# EAGLE design w5500-004 (EAGLE 6.5.0)
Assembly variants: Standard
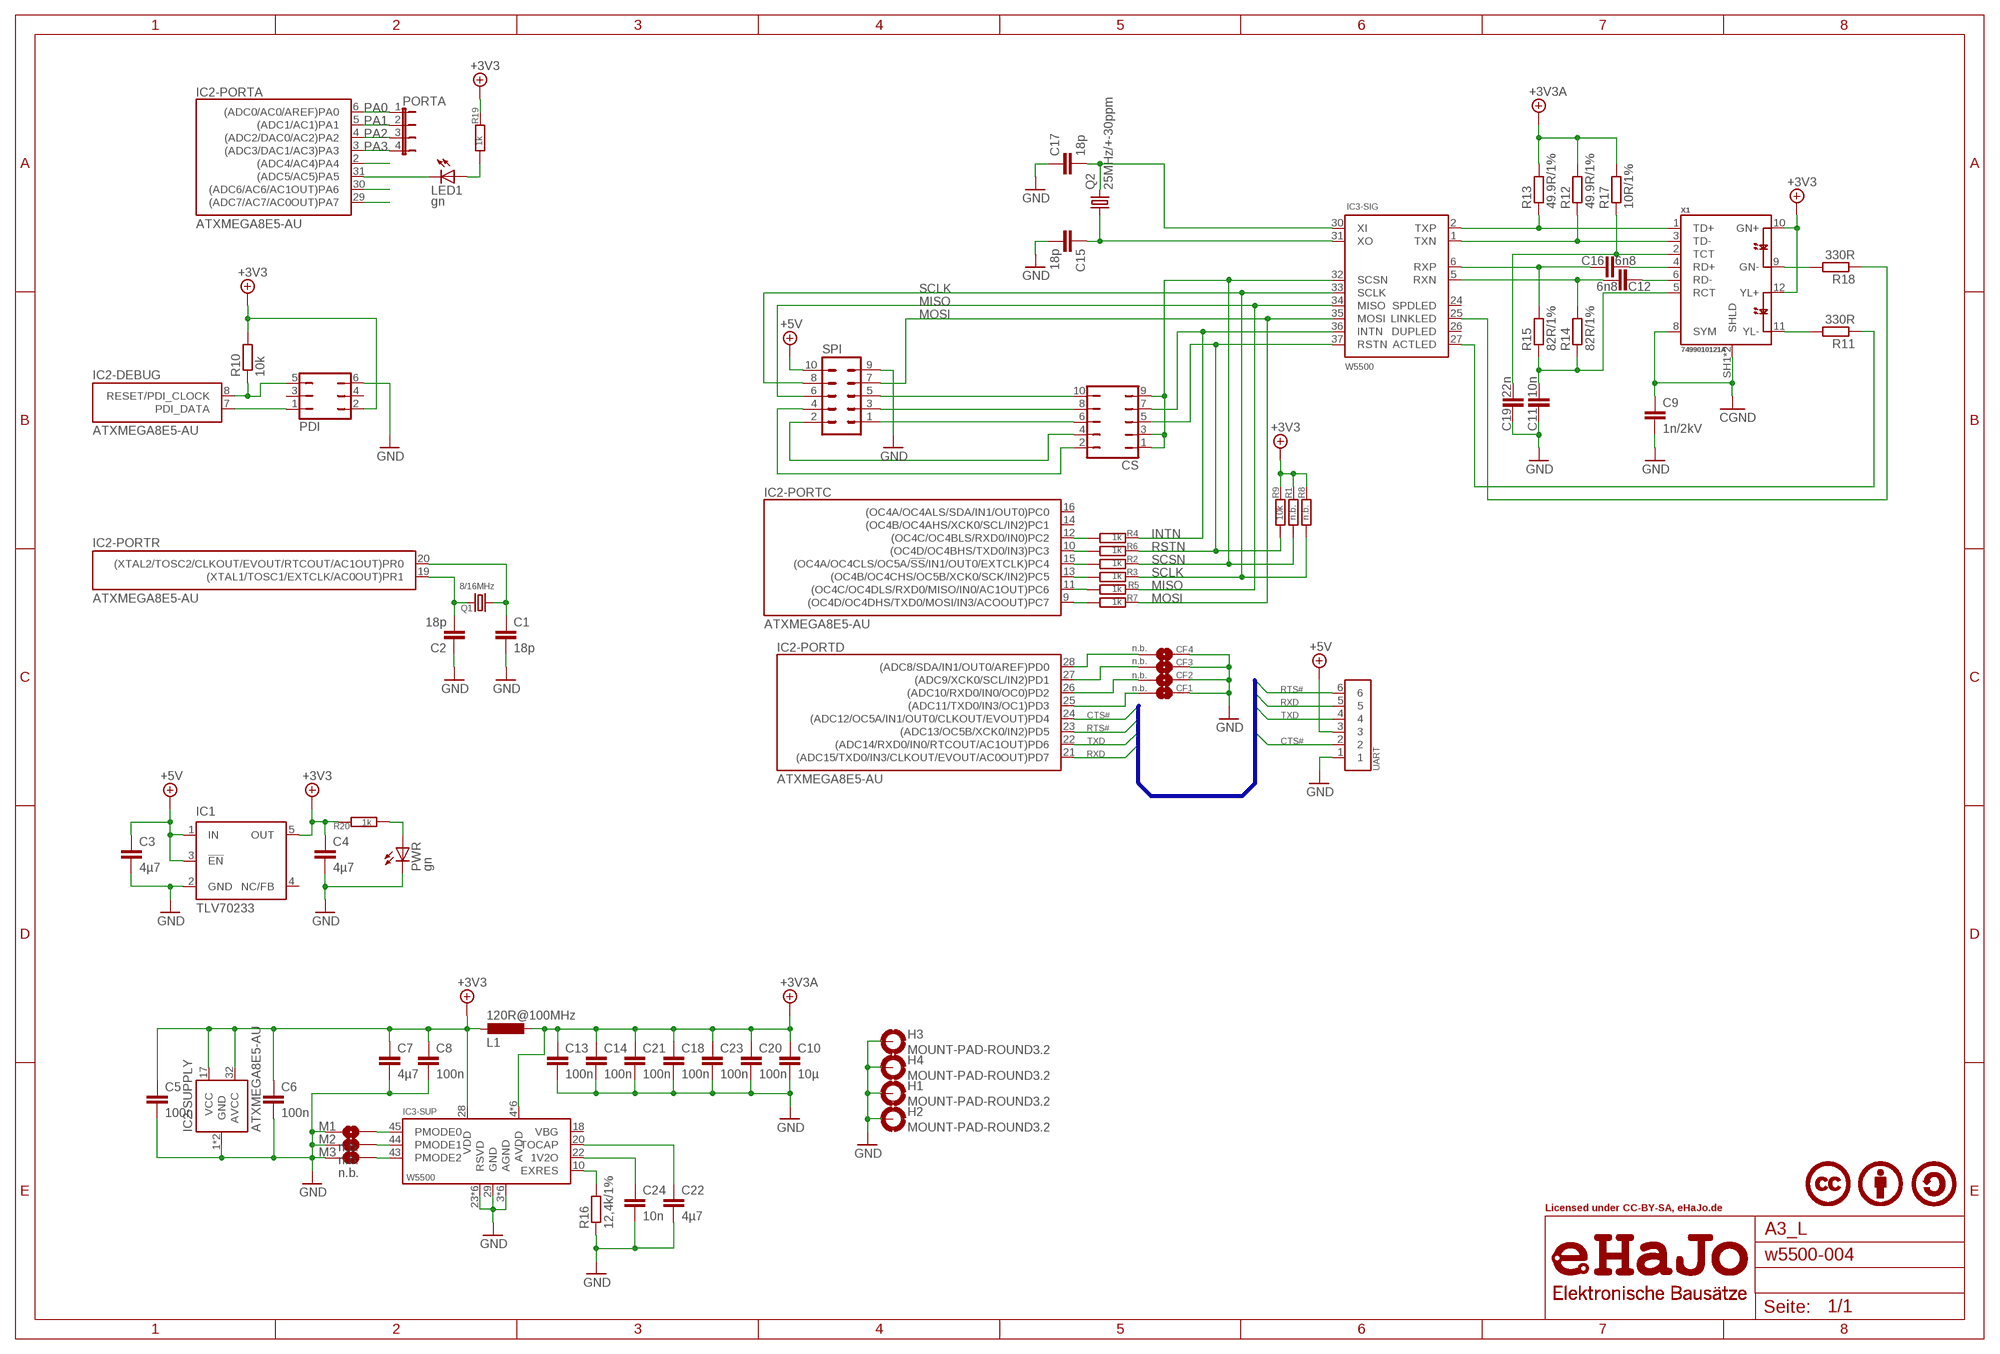
[diagram p0: schematic, sheet 1]

## Parts
C1  18p  CC0603  [C0603]
C2  18p  CC0603  [C0603]
C3  4µ7  CC0805  [C0805]
C4  4µ7  CC0805  [C0805]
C5  100n  CC0603  [C0603]
C6  100n  CC0603  [C0603]
C7  4µ7  CC0805  [C0805]
C8  100n  CC0603  [C0603]
C9  1n/2kV  CC0805  [C0805]
C10  10µ  CC1206  [C1206]
C11  10n  CC0603  [C0603]
C12  6n8  CC0603  [C0603]
C13  100n  CC0603  [C0603]
C14  100n  CC0603  [C0603]
C15  18p  CC0603  [C0603]
C16  6n8  CC0603  [C0603]
C17  18p  CC0603  [C0603]
C18  100n  CC0603  [C0603]
C19  22n  CC0603  [C0603]
C20  100n  CC0603  [C0603]
C21  100n  CC0603  [C0603]
C22  4µ7  CC0805  [C0805]
C23  100n  CC0603  [C0603]
C24  10n  CC0603  [C0603]
CF1  n.b.  SJS  [SJS]
CF2  n.b.  SJS  [SJS]  (not fitted in variant Standard)
CF3  n.b.  SJS  [SJS]  (not fitted in variant Standard)
CF4  n.b.  SJS  [SJS]  (not fitted in variant Standard)
CS  JP5Q  [JP5Q]  (not fitted in variant Standard)
H1  MOUNT-PAD-ROUND3.2  [3,2-PAD]  (not fitted in variant Standard)
H2  MOUNT-PAD-ROUND3.2  [3,2-PAD]  (not fitted in variant Standard)
H3  MOUNT-PAD-ROUND3.2  [3,2-PAD]  (not fitted in variant Standard)
H4  MOUNT-PAD-ROUND3.2  [3,2-PAD]  (not fitted in variant Standard)
IC1  TLV70233  TPS77001  [SOT23-DBV]
IC2  ATXMEGA8E5-AU  ATXMEGAE5-AU  [TQFP32-08]
IC3  W5500  [LQFP48]
L1  120R@100MHz  L0805  [R0805]
LED1  gn  LEDCHIP-LED0805  [CHIP-LED0805]
M1  n.b.  SJS  [SJS]  (not fitted in variant Standard)
M2  n.b.  SJS  [SJS]  (not fitted in variant Standard)
M3  n.b.  SJS  [SJS]  (not fitted in variant Standard)
PDI  JP3Q  [JP3Q]
PORTA  JP4ESML  [4SML]
PWR  gn  LEDCHIP-LED0805  [CHIP-LED0805]
Q1  8/16MHz  CRYSTALHC49U70  [HC49U70]  (not fitted in variant Standard)
Q2  25MHz/+-30ppm  CRYSTALHC49U70  [HC49U70]  (not fitted in variant Standard)
R1  n.b.  RR0603  [R0603]
R2  1k  RR0603  [R0603]
R3  1k  RR0603  [R0603]
R4  1k  RR0603  [R0603]
R5  1k  RR0603  [R0603]
R6  1k  RR0603  [R0603]
R7  1k  RR0603  [R0603]
R8  n.b.  RR0603  [R0603]
R9  10k  RR0603  [R0603]
R10  10k  RR0603  [R0603]
R11  330R  RR0603  [R0603]
R12  49.9R/1%  RR0603  [R0603]
R13  49.9R/1%  RR0603  [R0603]
R14  82R/1%  RR0603  [R0603]
R15  82R/1%  RR0603  [R0603]
R16  12,4k/1%  RR0603  [R0603]
R17  10R/1%  RR0603  [R0603]
R18  330R  RR0603  [R0603]
R19  1k  RR0603  [R0603]
R20  1k  RR0603  [R0603]
SPI  ML10  [ML10]  (not fitted in variant Standard)
UART  JP6E  [JP6E]  (not fitted in variant Standard)
X1  7499010121A  7499010121  [121A]  (not fitted in variant Standard)

## Nets
+3V3: C4.1 C5.1 C6.1 C7.1 C8.1 IC1.5(OUT) IC2.17(-SUPPLY:VCC) IC2.32(-SUPPLY:AVCC) IC3.28(-SUP:VDD) L1.2 PDI.2 R1.2 R8.2 R9.2 R10.2 R19.2 R20.2 X1.10(GN+) X1.12(YL+)
+3V3A: C10.1 C13.1 C14.1 C18.1 C20.1 C21.1 C23.1 IC3.4(-SUP:AVDD) IC3.8(-SUP:AVDD) IC3.11(-SUP:AVDD) IC3.15(-SUP:AVDD) IC3.17(-SUP:AVDD) IC3.21(-SUP:AVDD) L1.1 R12.2 R13.2 R17.2
+5V: C3.1 IC1.1(IN) IC1.3(!EN) SPI.10 UART.3
CGND: C9.1 X1.8(SYM) X1.SH1(SHLD) X1.SH2(SHLD)
CS1: CS.6 SPI.1
CS2: CS.4 SPI.2
CS3: CS.8 SPI.3
CS4: CS.2 SPI.4
CTS#: IC2.24(-PORTD:(ADC12/OC5A/IN1/OUT0/CLKOUT/EVOUT)PD4) UART.2
GND: C1.2 C2.1 C3.2 C4.2 C5.2 C6.2 C7.2 C8.2 C9.2 C10.2 C11.1 C13.2 C14.2 C15.2 C17.1 C18.2 C19.1 C20.2 C21.2 C22.2 C23.2 C24.2 CF1.2 CF2.2 CF3.2 CF4.2 H1.B3,2(MOUNT) H2.B3,2(MOUNT) H3.B3,2(MOUNT) H4.B3,2(MOUNT) IC1.2(GND) IC2.1(-SUPPLY:GND) IC2.18(-SUPPLY:GND) IC3.3(-SUP:AGND) IC3.9(-SUP:AGND) IC3.14(-SUP:AGND) IC3.16(-SUP:AGND) IC3.19(-SUP:AGND) IC3.23(-SUP:RSVD) IC3.29(-SUP:GND) IC3.38(-SUP:RSVD) IC3.39(-SUP:RSVD) IC3.40(-SUP:RSVD) IC3.41(-SUP:RSVD) IC3.42(-SUP:RSVD) IC3.48(-SUP:AGND) M1.1 M2.1 M3.1 PDI.6 PWR.C R16.1 SPI.9 UART.1
INTN: CS.7 IC3.36(-SIG:INTN) R4.1
MISO: IC3.34(-SIG:MISO) R5.1 SPI.6
MOSI: IC3.35(-SIG:MOSI) R7.1 SPI.7
N$1: IC3.10(-SUP:EXRES) R16.2
N$2: C24.1 IC3.22(-SUP:1V2O)
N$3: C22.1 IC3.20(-SUP:TOCAP)
N$4: IC3.45(-SUP:PMODE0) M1.2
N$5: R18.2 X1.9(GN-)
N$6: IC3.44(-SUP:PMODE1) M2.2
N$7: IC3.43(-SUP:PMODE2) M3.2
N$8: C15.1 IC3.31(-SIG:XO) Q2.1
N$9: C17.2 IC3.30(-SIG:XI) Q2.2
N$10: IC2.8(-DEBUG:RESET/PDI_CLOCK) PDI.5 R10.1
N$11: IC2.11(-PORTC:(OC4C/OC4DLS/RXD0/MISO/IN0/AC1OUT)PC6) R5.2
N$12: IC2.12(-PORTC:(OC4C/OC4BLS/RXD0/IN0)PC2) R4.2
N$13: IC2.15(-PORTC:(OC4A/OC4CLS/OC5A/!SS!/IN1/OUT0/EXTCLK)PC4) R2.2
N$14: IC2.9(-PORTC:(OC4D/OC4DHS/TXD0/MOSI/IN3/ACOOUT)PC7) R7.2
N$15: IC2.13(-PORTC:(OC4B/OC4CHS/OC5B/XCK0/SCK/IN2)PC5) R3.2
N$16: CF4.1 IC2.28(-PORTD:(ADC8/SDA/IN1/OUT0/AREF)PD0)
N$17: CF3.1 IC2.27(-PORTD:(ADC9/XCK0/SCL/IN2)PD1)
N$18: IC2.10(-PORTC:(OC4D/OC4BHS/TXD0/IN3)PC3) R6.2
N$19: CF2.1 IC2.26(-PORTD:(ADC10/RXD0/IN0/OC0)PD2)
N$20: IC2.7(-DEBUG:PDI_DATA) PDI.1
N$21: CF1.1 IC2.25(-PORTD:(ADC11/TXD0/IN3/OC1)PD3)
N$23: C16.2 X1.4(RD+)
N$24: C12.1 X1.6(RD-)
N$27: C11.2 R14.1 R15.1 X1.5(RCT)
N$28: C19.2 R17.1 X1.2(TCT)
N$29: R11.2 X1.11(YL-)
N$30: IC3.27(-SIG:ACTLED) R11.1
N$31: IC3.25(-SIG:LINKLED) R18.1
N$33: IC2.2(-PORTA:(ADC4/AC4)PA4)
N$34: IC2.31(-PORTA:(ADC5/AC5)PA5) LED1.C
N$35: IC2.30(-PORTA:(ADC6/AC6/AC1OUT)PA6)
N$36: IC2.29(-PORTA:(ADC7/AC7/AC0OUT)PA7)
N$37: C2.2 IC2.19(-PORTR:(XTAL1/TOSC1/EXTCLK/AC0OUT)PR1) Q1.1
N$38: C1.1 IC2.20(-PORTR:(XTAL2/TOSC2/CLKOUT/EVOUT/RTCOUT/AC1OUT)PR0) Q1.2
N$39: PWR.A R20.1
N$40: LED1.A R19.1
PA0: IC2.6(-PORTA:(ADC0/AC0/AREF)PA0) PORTA.1
PA1: IC2.5(-PORTA:(ADC1/AC1)PA1) PORTA.2
PA2: IC2.4(-PORTA:(ADC2/DAC0/AC2)PA2) PORTA.3
PA3: IC2.3(-PORTA:(ADC3/DAC1/AC3)PA3) PORTA.4
RSTN: CS.5 IC3.37(-SIG:RSTN) R6.1 R9.1
RTS#: IC2.23(-PORTD:(ADC13/OC5B/XCK0/IN2)PD5) UART.6
RX+: C16.1 IC3.6(-SIG:RXP) R15.2
RX-: C12.2 IC3.5(-SIG:RXN) R14.2
RXD: IC2.21(-PORTD:(ADC15/TXD0/IN3/CLKOUT/EVOUT/AC0OUT)PD7) UART.5
SCLK: IC3.33(-SIG:SCLK) R3.1 R8.1 SPI.8
SCSN: CS.1 CS.3 CS.9 IC3.32(-SIG:SCSN) R1.1 R2.1
SS: CS.10 SPI.5
TD+: IC3.2(-SIG:TXP) R13.1 X1.1(TD+)
TD-: IC3.1(-SIG:TXN) R12.1 X1.3(TD-)
TXD: IC2.22(-PORTD:(ADC14/RXD0/IN0/RTCOUT/AC1OUT)PD6) UART.4
Unconnected: IC1.4(NC/FB) IC2.14(-PORTC:(OC4B/OC4AHS/XCK0/SCL/IN2)PC1) IC2.16(-PORTC:(OC4A/OC4ALS/SDA/IN1/OUT0)PC0) IC3.18(-SUP:VBG) IC3.24(-SIG:SPDLED) IC3.26(-SIG:DUPLED) PDI.3 PDI.4

## Buses
RTS#,RXD,TXD,CTS#

## Notes on the sheet
- Licensed under CC-BY-SA, eHaJo.de

## Library data of the parts
C1-C24 = rcl:C: CAPACITOR, European symbol
CF1-CF4 M1-M3 = jumper:SJ: SMD solder JUMPER
CS = jumper:JP5Q: JUMPER
H1-H4 = holes:MOUNT-PAD-ROUND: MOUNTING PAD, round
IC1 = texas:TPS770*: ULTRALOW-POWER 50-mA LOW-DROPOUT LINEAR REGULATORS 50-mA Low-Dropout Regulator Source: http://focus.ti.com/lit/ds/symlink/tps77001.pdf
IC2 = atmel:ATXMEGA*E5
IC3 = wiznet:W5500
L1 = rcl:L: INDUCTOR, European symbol
LED1 PWR = led:LED: LED OSRAM: - CHIPLED LG R971, LG N971, LY N971, LG Q971, LY Q971, LO R971, LY R971 LH N974, LH R974 LS Q976, LO Q976, LY Q976 LO Q996 - Hyper CHIPLED LW Q18S LB Q993, LB Q99A, LB R99A - SideLED LS A670, LO A670, LY A670, LG A670, LP A670 LB A673, LV A673, LT A673, LW A673 LH A674 LY A675 LS A676, LA A676, LO A676, LY A676, LW A676 LS A679, LY A679, LG A679 - Hyper Micro SIDELED® LS Y876, LA Y876, LO Y876, LY Y876 LT Y87S - SmartLED LW L88C, LW L88S LB L89C, LB L89S, LG L890 LS L89K, LO L89K, LY L89K LS L896, LA L896, LO L896, LY L896 - TOPLED LS T670, LO T670, LY T670, LG T670, LP T670 LSG T670, LSP T670, LSY T670, LOP T670, LYG T670 LG T671, LOG T671, LSG T671 LB T673, LV T673, LT T673, LW T673 LH T674 LS T676, LA T676, LO T676, LY T676, LB T676, LH T676, LSB T676, LW T676 LB T67C, LV T67C, LT T67C, LS T67K, LO T67K, LY T67K, LW E67C LS E67B, LA E67B, LO E67B, LY E67B, LB E67C, LV E67C, LT E67C LW T67C LS T679, LY T679, LG T679 LS T770, LO T770, LY T770, LG T770, LP T770 LB T773, LV T773, LT T773, LW T773 LH T774 LS E675, LA E675, LY E675, LS T675 LS T776, LA T776, LO T776, LY T776, LB T776 LHGB T686 LT T68C, LB T68C - Hyper Mini TOPLED® LB M676 - Mini TOPLED Santana® LG M470 LS M47K, LO M47K, LY M47K Source: http://www.osram.convergy.de LUXEON: - LUMILED® LXK2-PW12-R00, LXK2-PW12-S00, LXK2-PW14-U00, LXK2-PW14-V00 LXK2-PM12-R00, LXK2-PM12-S00, LXK2-PM14-U00 LXK2-PE12-Q00, LXK2-PE12-R00, LXK2-PE12-S00, LXK2-PE14-T00, LXK2-PE14-U00 LXK2-PB12-K00, LXK2-PB12-L00, LXK2-PB12-M00, LXK2-PB14-N00, LXK2-PB14-P00, LXK2-PB14-Q00 LXK2-PR12-L00, LXK2-PR12-M00, LXK2-PR14-Q00, LXK2-PR14-R00 LXK2-PD12-Q00, LXK2-PD12-R00, LXK2-PD12-S00 LXK2-PH12-R00, LXK2-PH12-S00 LXK2-PL12-P00, LXK2-PL12-Q00, LXK2-PL12-R00 Source: www.luxeon.com KINGBRIGHT: KA-3528ASYC Source: www.kingbright.com
PDI = jumper:JP3Q: JUMPER
PORTA = jumper:JP4E: JUMPER
Q1 Q2 = crystal:CRYSTAL: CRYSTAL
R1-R20 = rcl:R: RESISTOR, European symbol
SPI = con-ml:ML10: HARTING; OC_FARNELL: unknown; OC_NEWARK: unknown
UART = jumper:JP6E
X1 = wuerth:7499010

## Board
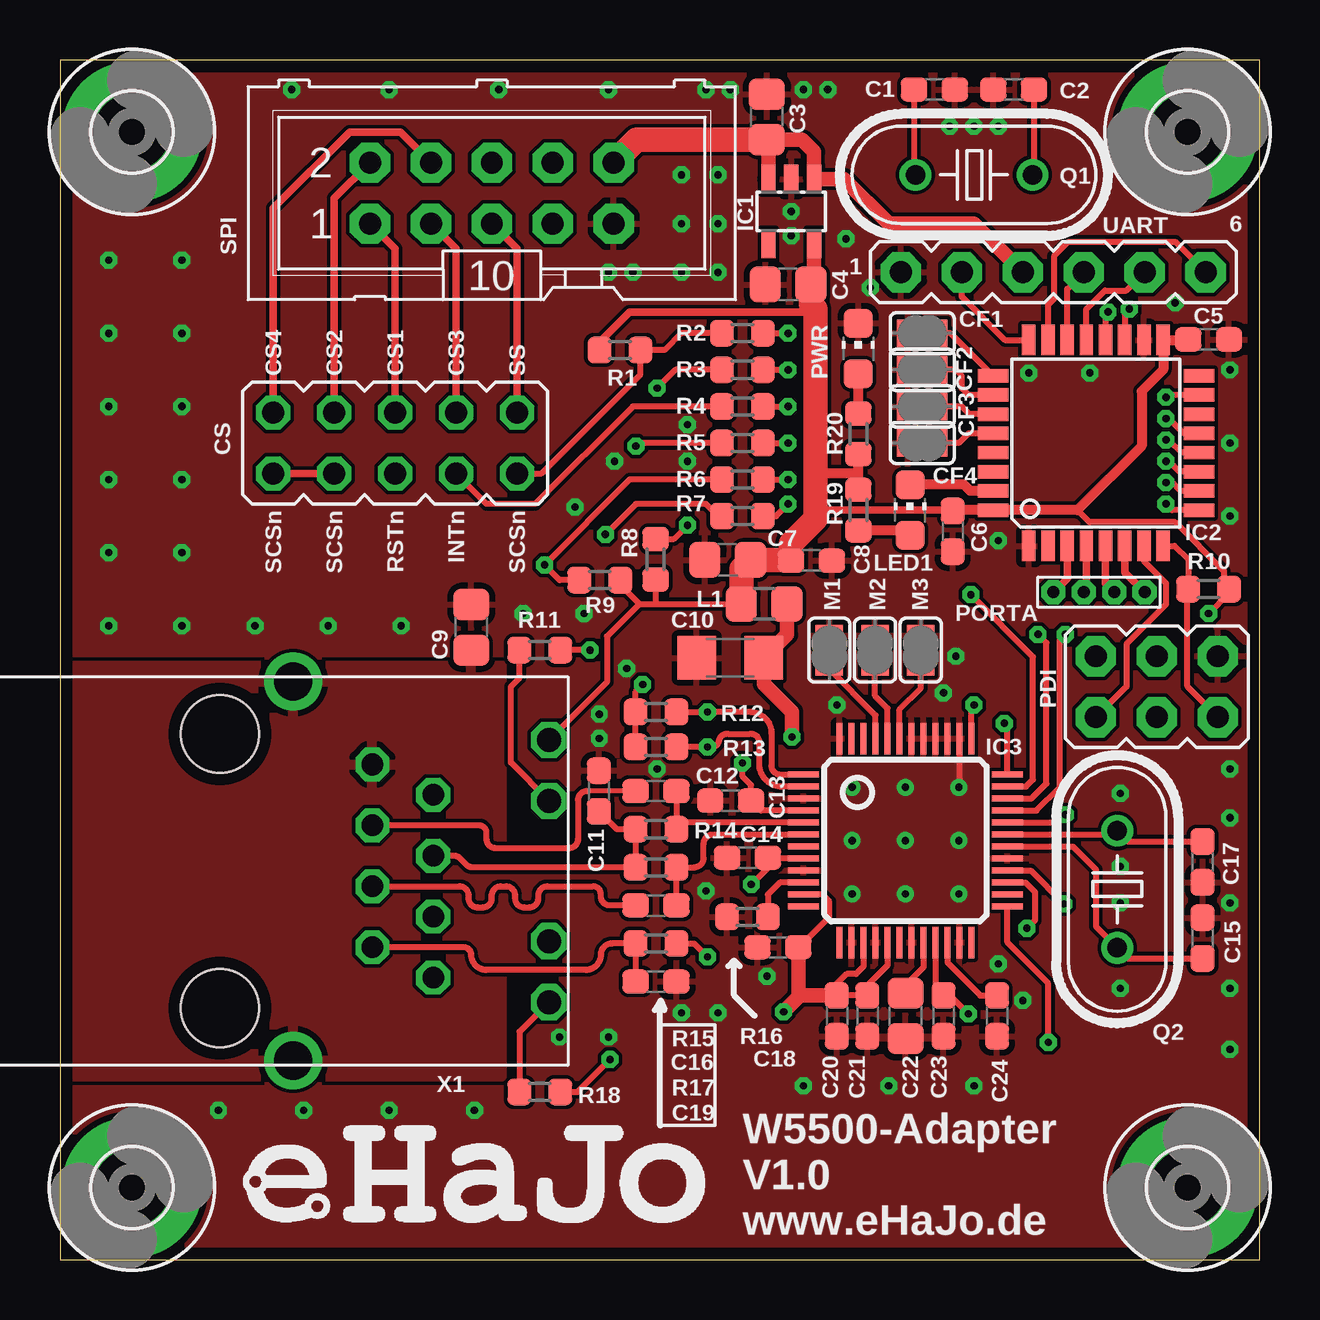
[diagram p1: board, top side]
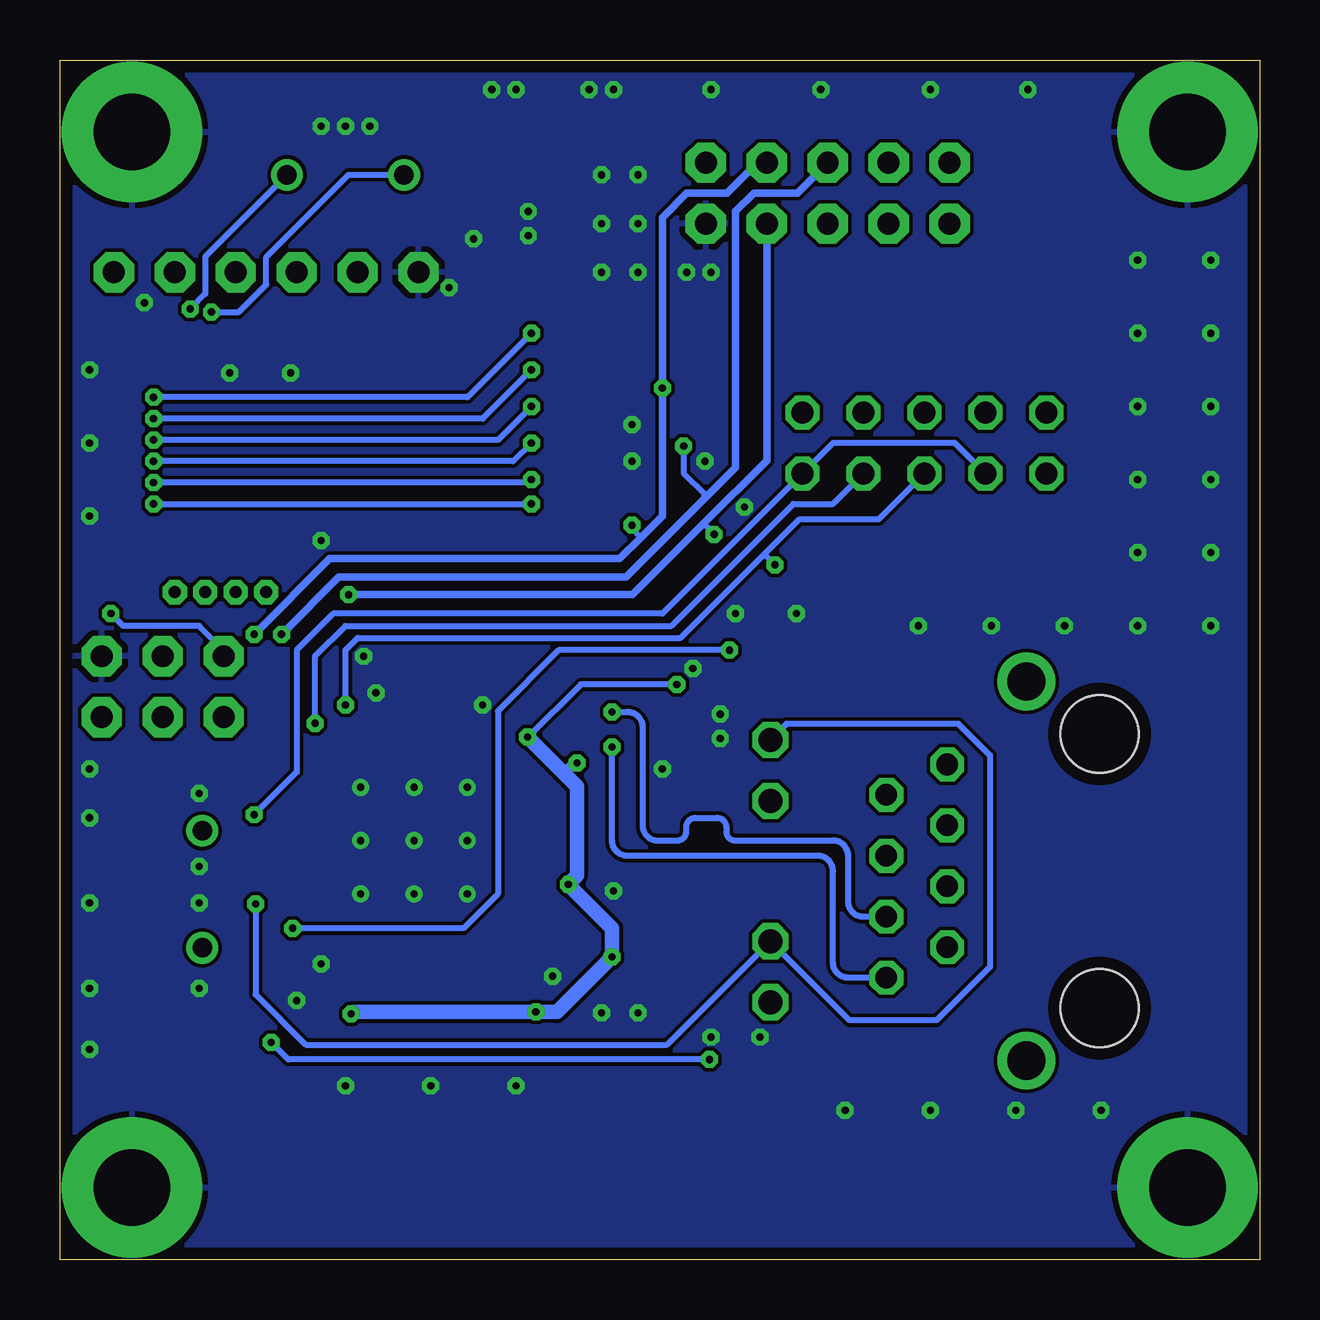
[diagram p2: board, bottom side, seen from below]

Size 50 x 50 mm. Coordinates in mm from the lower left corner, seen from the top.
Outline: 0,0 50,0 50,50 0,50 0,0
Copper layers (1*16): Top 0.035mm / dielectric 1.5mm / Bottom 0.035mm
Design rules "default *": minimum track width 8mil, minimum drill 0.3mm, track to track 6mil, track to pad 6mil, pad to pad 6mil, via to via 6mil, smd to smd 6mil, copper to edge 20mil, drill to drill 0.4mm, minimum pad ring 10mil, minimum via ring 8mil, stop-mask expansion 4mil, vias tented up to drill 0mil, thermal gap 10mil

### Footprints (pad centres in the part's own frame; a part is rotated, then mirrored left to right if it is on the bottom)
C0603 = smd 1.1 x 1: 1 -0.85,0; 2 0.85,0
C0805 = smd 1.3 x 1.5: 1 -0.95,0; 2 0.95,0
C1206 = smd 1.6 x 1.8: 1 -1.4,0; 2 1.4,0
SJS = smd 0.889 x 1.143: 1 -0.603,0; 2 0.603,0
JP5Q = drill 0.914 octagon: 1 -5.08,-1.27; 2 -5.08,1.27; 3 -2.54,-1.27; 4 -2.54,1.27; 5 0,-1.27; 6 0,1.27; 7 2.54,-1.27; 8 2.54,1.27; 9 5.08,-1.27; 10 5.08,1.27
3,2-PAD = drill 3.2 pad 5.842: B3,2 0,0
SOT23-DBV = smd 0.6 x 1.2: 1 -0.95,-1.35; 2 0,-1.35; 3 0.95,-1.35; 4 0.95,1.35; 5 -0.95,1.35
TQFP32-08 = smd 1.27 x 0.559: 1 -4.293,2.8; 2 -4.293,2; 3 -4.293,1.2; 4 -4.293,0.4; 5 -4.293,-0.4; 6 -4.293,-1.2; 7 -4.293,-2; 8 -4.293,-2.8; 17 4.293,-2.8; 18 4.293,-2; 19 4.293,-1.2; 20 4.293,-0.4; 21 4.293,0.4; 22 4.293,1.2; 23 4.293,2; 24 4.293,2.8 | smd 0.559 x 1.27: 9 -2.8,-4.293; 10 -2,-4.293; 11 -1.2,-4.293; 12 -0.4,-4.293; 13 0.4,-4.293; 14 1.2,-4.293; 15 2,-4.293; 16 2.8,-4.293; 25 2.8,4.293; 26 2,4.293; 27 1.2,4.293; 28 0.4,4.293; 29 -0.4,4.293; 30 -1.2,4.293; 31 -2,4.293; 32 -2.8,4.293
LQFP48 = smd 0.25 x 1.3: 1 -2.75,-4.25; 2 -2.25,-4.25; 3 -1.75,-4.25; 4 -1.25,-4.25; 5 -0.75,-4.25; 6 -0.25,-4.25; 7 0.25,-4.25; 8 0.75,-4.25; 9 1.25,-4.25; 10 1.75,-4.25; 11 2.25,-4.25; 12 2.75,-4.25; 25 2.75,4.25; 26 2.25,4.25; 27 1.75,4.25; 28 1.25,4.25; 29 0.75,4.25; 30 0.25,4.25; 31 -0.25,4.25; 32 -0.75,4.25; 33 -1.25,4.25; 34 -1.75,4.25; 35 -2.25,4.25; 36 -2.75,4.25 | smd 1.3 x 0.25: 13 4.25,-2.75; 14 4.25,-2.25; 15 4.25,-1.75; 16 4.25,-1.25; 17 4.25,-0.75; 18 4.25,-0.25; 19 4.25,0.25; 20 4.25,0.75; 21 4.25,1.25; 22 4.25,1.75; 23 4.25,2.25; 24 4.25,2.75; 37 -4.25,2.75; 38 -4.25,2.25; 39 -4.25,1.75; 40 -4.25,1.25; 41 -4.25,0.75; 42 -4.25,0.25; 43 -4.25,-0.25; 44 -4.25,-0.75; 45 -4.25,-1.25; 46 -4.25,-1.75; 47 -4.25,-2.25; 48 -4.25,-2.75
R0805 = smd 1.3 x 1.5: 1 -0.95,0; 2 0.95,0
CHIP-LED0805 = smd 1.2 x 1.2: A 0,-1.05; C 0,1.05
JP3Q = drill 0.914 pad 1.676 octagon: 1 -2.54,-1.27; 2 -2.54,1.27; 3 0,-1.27; 4 0,1.27; 5 2.54,-1.27; 6 2.54,1.27
4SML = drill 0.5 octagon: 1 0,0; 2 1.27,0; 3 2.54,0; 4 3.81,0
HC49U70 = drill 0.813: 1 -2.44,0; 2 2.44,0
R0603 = smd 1 x 1.1: 1 -0.85,0; 2 0.85,0
ML10 = drill 0.914 pad 1.676 octagon: 1 -5.08,-1.27; 2 -5.08,1.27; 3 -2.54,-1.27; 4 -2.54,1.27; 5 0,-1.27; 6 0,1.27; 7 2.54,-1.27; 8 2.54,1.27; 9 5.08,-1.27; 10 5.08,1.27
JP6E = drill 0.914 pad 1.676 octagon: 1 0,0; 2 2.54,0; 3 5.08,0; 4 7.62,0; 5 10.16,0; 6 12.7,0
121A = drill 0.9 octagon: 1 -4.445,-8.89; 2 -3.175,-6.35; 3 -1.905,-8.89; 4 -0.635,-6.35; 5 0.635,-8.89; 6 1.905,-6.35; 7 3.175,-8.89; 8 4.445,-6.35 | drill 1 octagon: 9 -5.465,-13.72; 10 -2.925,-13.72; 11 2.925,-13.72; 12 5.465,-13.72 | drill 1.6: SH1 -7.9,-3.05; SH2 7.9,-3.05 | hole 3.25: -5.715,0; 5.715,0

### Placement (x,y rotation side)
C1  36.45,48.77 0 top
C2  39.75,48.77 0 top
C3  29.46,47.62 90 top
C4  30.35,40.64 180 top
C5  47.88,38.35 0 top
C6  37.21,30.35 270 top
C7  27.83,29.16 180 top
C8  31.32,29.13 0 top
C9  17.14,26.35 90 top
C10  27.94,25.08 180 top
C11  22.46,19.53 270 top
C12  24.84,19.53 0 top
C13  27.96,19.13 180 top
C14  28.65,16.75 180 top
C15  47.62,16.57 270 top
C16  24.84,14.76 180 top
C17  47.62,13.4 270 top
C18  29.92,13.02 180 top
C19  24.84,11.59 180 top
C20  32.38,10.16 270 top
C21  33.66,10.16 270 top
C22  35.24,10.16 270 top
C23  36.83,10.16 270 top
C24  39.05,10.16 270 top
CF1  35.94,38.61 180 top
CF2  35.94,37.08 180 top
CF3  35.94,35.56 180 top
CF4  35.94,34.04 180 top
CS  13.97,34.04 0 top
H1  3,47 0 top
H2  47,47 0 top
H3  3,3 0 top
H4  47,3 0 top
IC1  30.48,43.69 180 top
IC2  43.18,34.04 90 top
IC3  35.24,17.46 270 top
L1  29.35,27.32 180 top
LED1  35.43,31.24 0 top
M1  32.07,25.4 270 top
M2  33.97,25.4 270 top
M3  35.88,25.4 270 top
PDI  45.72,23.88 0 top
PORTA  45.21,27.81 180 top
PWR  33.27,37.97 0 top
Q1  38.1,45.21 180 top
Q2  44.07,15.43 270 top
R1  23.34,37.91 180 top
R2  28.45,38.61 0 top
R3  28.45,37.08 0 top
R4  28.45,35.56 0 top
R5  28.45,34.04 0 top
R6  28.45,32.51 0 top
R7  28.45,30.99 0 top
R8  24.83,29.18 270 top
R9  22.5,28.32 0 top
R10  47.88,27.94 0 top
R11  20,25.4 180 top
R12  24.84,22.83 180 top
R13  24.84,21.37 180 top
R14  24.84,17.94 0 top
R15  24.84,16.35 0 top
R16  28.65,14.29 0 top
R17  24.84,13.18 0 top
R18  20,6.99 180 top
R19  33.27,31.24 90 top
R20  33.27,34.42 270 top
SPI  18,44.45 0 top
UART  35.05,41.15 0 top
X1  6.67,16.19 90 top

### Tracks (layer width: path | path; a pad name or v marks a point on that pad's centre or on a via)
+3V3  (via drill 0.3)
  Top 0.254: IC3.28 40.46,16.21 v41.85,14.83 | X1.12 22.8,24.07 22.8,25.97 24.15,27.32 | 24.15,27.32 24.89,27.32 | 24.89,27.32 L1.2 | 42.41,31.24 42.91,30.73 46.48,30.73 48.51,28.7 48.51,27.94 R10.2 48.73,27.77 v47.88,26.92 | R8.2 24.83,27.39 24.89,27.32 | R9.2 23.35,28.12 24.15,27.32 | 30.98,39.5 31.3,39.82
  Top 0.305: R1.2 22.49,38.24 23.75,39.5 30.98,39.5 | 37.21,31.24 31.5,31.24
  Top 0.406: C5.1 47,38.33 IC2.17 45.98,37.09 45.09,36.2 45.09,33.91 42.41,31.24 IC2.32 37.24,31.24 C6.1 37.21,31.24 | R20.2 R19.2 33.27,32.77 31.5,32.77
  Top 0.61: C8.1 30.44,29.16 | IC1.5 31.43,40.77 C4.1
  Top 1.016: 30.44,29.16 C7.1 28.4,28.79 L1.2 | C4.1 31.3,39.82 31.5,39.62 31.5,32.77 31.5,31.24 31.5,30.86 30.47,29.84 C8.1
  Bottom 0.254: v41.85,14.83 41.85,11.05 39.75,8.95 24.7,8.95 X1.10 17.09,9.97 13.46,9.97 11.24,12.19 11.24,21.02 12.54,22.32 19.72,22.32 X1.12 | PDI.2 43.18,25.4 44.2,26.42 47.37,26.42 v47.88,26.92
+3V3A  (via drill 0.3)
  Top 0.254: R13.2 R12.2 23.99,23.68 v24.29,23.97 | IC3.17 34.49,12.27 33.66,11.43 C21.1 C20.1 32.38,11.51 32.78,11.91 33.18,11.91 33.49,12.22 IC3.15 | IC3.11 31.78,15.21 32.07,14.92 32.07,14.29 30.8,13.02 C18.1 | IC3.8 29.54,16.71 C14.1 29.5,16.33 v28.81,15.64 | R17.2 26.43,13.18 v26.99,12.62 | IC3.21 36.49,11.35 C23.1 37.09,11.01 v37.86,10.24 | IC3.4 29.22,18.71 C13.1 28.81,19.77 28.45,20.13 v28.45,20.7
  Top 0.61: v30.16,10.32 30.85,11.01 | 30.85,11.01 C20.1 | C18.1 30.77,11.09 30.85,11.01 | L1.1 30.3,26.05 C10.1 29.34,24 30.51,22.83 v30.51,21.78
  Bottom 0.254: v24.29,23.97 28.29,23.97 30.48,21.78 v30.51,21.78
  Bottom 0.406: v28.45,20.7 28.57,20.7 29,20.27
  Bottom 0.61: v37.86,10.24 37.78,10.32 v30.16,10.32 29.29,10.32 v26.99,12.62 26.99,13.81 v28.81,15.64 28.45,16 28.45,19.72 29,20.27 v30.51,21.78
+5V
  Top 0.61: UART.3 38.1,43.18 34.54,43.18 32.69,45.04 IC1.1 31.43,46.17 30.92,46.67 C3.1 29.53,46.61 IC1.3
  Top 1.016: SPI.10 24.04,46.67 C3.1
CGND
  pour Top: 18.41,7.62 -1.59,7.62 -1.59,24.77 18.41,24.77
CS1
  Top 0.305: CS.6 13.97,42.13 SPI.1
CS2
  Top 0.305: CS.4 11.43,44.23 SPI.2
CS3
  Top 0.305: CS.8 16.51,42.13 SPI.3
CS4
  Top 0.305: CS.2 8.89,43.81 12.06,46.99 14.19,46.99 SPI.4
CTS#
  Top 0.254: UART.2 37.59,40.13 39.4,38.33 IC2.24
GND  (via drill 0.3)
  Top 0.254: IC3.38 37.49,19.79
  other vias: 35.24,17.46 35.24,19.68 37.47,17.46 37.47,19.68 37.47,15.24 35.24,15.24 33.02,15.24 33.02,17.46 33.02,19.68 2.03,26.42 5.08,26.42 8.13,26.42 11.18,26.42 14.22,26.42 30.99,48.77 32,48.77 27.94,48.77 26.92,48.77 30.48,43.69 30.48,42.67 37.08,47.24 38.1,47.24 39.12,47.24 48.77,37.08 48.77,34.04 48.77,30.99 39.12,29.97 40.39,36.96 42.93,36.96 46.48,39.88 37.34,25.15 36.83,23.62 32.38,23.11 22.48,21.72 22.48,22.73 23.62,24.64 24.89,20.45 26.92,15.37 29.46,11.81 25.91,10.29 27.43,10.29 20.83,9.27 22.86,9.27 30.99,7.24 34.54,7.24 38.1,7.24 39.12,12.32 40.13,10.79 44.2,14.86 44.2,16.38 44.2,11.3 44.2,19.43 48.77,20.45 48.77,18.41 48.77,14.86 48.77,11.3 48.77,8.76 6.6,6.22 10.16,6.22 13.72,6.22 17.27,6.22 2.03,29.46 2.03,32.51 2.03,35.56 2.03,38.61 2.03,41.66 27.43,41.15 25.91,41.15 25.91,43.18 27.43,43.18 25.91,45.21 27.43,45.21 22.86,48.77 18.29,48.77 13.72,48.77 9.65,48.77 23.88,41.15 22.86,41.15 23.11,33.27 26.16,33.27 21.46,31.37 19.3,26.92 21.84,26.92 5.08,29.46 5.08,32.51 5.08,35.56 5.08,38.61 5.08,41.66 26.16,34.8 32.77,42.55 33.78,40.51
  pour Bottom: 0,53.34 50.8,53.34 50.8,0 0,0
  pour Top (rank 2): 0,0 53.34,0 53.34,50.8 0,50.8
INTN  (via drill 0.3)
  Top 0.254: IC3.36 39.49,22.23 v39.37,22.35 | CS.7 17.78,31.5 19.81,31.5 23.88,35.56 R4.1
  Bottom 0.254: v39.37,22.35 39.37,25.15 38.1,26.42 24.51,26.42 19.43,31.5 17.78,31.5 CS.7
MISO  (via drill 0.3)
  Top 0.254: IC3.34 40.48,19.21 41.12,19.84 41.12,25.71 v40.77,26.06 | R5.1 24.13,34.04 v24,33.91
  Bottom 0.254: v24,33.91 24,32.77 23.11,31.88
  Bottom 0.305: SPI.6 19.27,44.45 21.08,44.45 21.84,43.69 21.84,33.02 23.11,31.75 | v40.77,26.06 38.38,28.45 26.42,28.45 23.11,31.75 | 23.11,31.88 23.11,31.75
MOSI  (via drill 0.3)
  Top 0.254: IC3.35 40.27,19.71 40.56,20 40.56,25.12 v37.97,27.71 | v22.73,30.23 24,31.5 26.92,31.5 27.43,30.99 R7.1
  Bottom 0.254: v22.73,30.23 23.18,30.67
  Bottom 0.305: SPI.7 20.54,33.31 23.18,30.67 26.14,27.71 v37.97,27.71
N$1
  Top 0.254: IC3.10 30,15.71 29.5,15.22 R16.2
N$2
  Top 0.254: IC3.22 36.99,12.38 38.36,11.01 C24.1
N$3
  Top 0.254: IC3.20 35.99,12.18 35.24,11.43 C22.1
N$4
  Top 0.254: IC3.45 33.99,22.68 32.07,24.61 M1.2
N$5
  Top 0.254: X1.9 19.15,9.49 R18.2
N$6
  Top 0.254: IC3.44 34.49,22.98 33.97,23.5 M2.2
N$7
  Top 0.254: IC3.43 34.99,22.93 35.88,23.81 M3.2
N$8
  Top 0.254: IC3.31 43.91,17.71 Q2.1 44.52,17.42 C15.1
N$9
  Top 0.254: IC3.30 42.22,17.21 43.18,16.26 43.18,13.88 Q2.2 44.51,12.55 C17.2
N$10
  Top 0.254: IC2.8 46.46,29.74 47.03,29.17 R10.1 | 47.24,27.73 R10.1 | PDI.5 46.99,23.88 46.99,27.9 R10.1
N$11  (via drill 0.3)
  Top 0.254: R5.2 v30.35,34.04 | IC2.11 46.67,32.84 46.23,33.27 v46.1,33.27
  Bottom 0.254: v30.35,34.04 31.11,33.27 v46.1,33.27
N$12  (via drill 0.3)
  Top 0.254: R4.2 v30.35,35.56 | IC2.12 46.76,33.64 46.23,34.16 v46.1,34.16
  Bottom 0.254: v30.35,35.56 31.75,34.16 v46.1,34.16
N$13  (via drill 0.3)
  Top 0.254: R2.2 v30.35,38.61 | IC2.15 46.2,36.04 v46.1,35.94
  Bottom 0.254: v30.35,38.61 33.02,35.94 v46.1,35.94
N$14  (via drill 0.3)
  Top 0.254: IC2.9 46.36,31.24 v46.1,31.5 | R7.2 29.84,30.99 v30.35,31.5
  Bottom 0.254: v46.1,31.5 v30.35,31.5
N$15  (via drill 0.3)
  Top 0.254: R3.2 v30.35,37.08 | IC2.13 46.84,34.44 46.23,35.05 v46.1,35.05
  Bottom 0.254: v30.35,37.08 32.38,35.05 v46.1,35.05
N$16
  Top 0.254: IC2.28 37.87,34.44 37.47,34.04 CF4.1
N$17
  Top 0.254: IC2.27 37.92,35.24 37.59,35.56 CF3.1
N$18  (via drill 0.3)
  Top 0.254: R6.2 v30.35,32.51 | IC2.10 46.7,32.04 46.35,32.38 v46.1,32.38
  Bottom 0.254: v30.35,32.51 30.48,32.38 v46.1,32.38
N$19
  Top 0.254: IC2.26 37.88,36.04 37.59,36.32 37.59,36.83 37.34,37.08 CF2.1
N$20
  Top 0.254: IC2.7 45.18,29.11 46.1,28.19 46.1,27.3 44.45,25.65 44.45,23.88 PDI.1
N$21
  Top 0.254: IC2.25 37.12,38.61 CF1.1
N$23
  Top 0.254: C16.2 22.92,14.76 arc-90 22.54,15.14 22.54,15.24 arc90 22.23,15.56 20.32,15.56 arc90 19.94,15.18 19.94,15.06 arc-90 19.56,14.68 19.35,14.68 arc-90 18.97,15.06 18.97,15.18 arc90 18.59,15.56 18.38,15.56 arc90 18,15.18 18,15.06 arc-90 17.62,14.68 17.41,14.68 arc-90 17.03,15.06 17.03,15.18 arc90 16.65,15.56 X1.4
N$24
  Top 0.203: C12.1 21.97,19.53
  Top 0.254: 21.97,19.53 arc90 21.59,19.14 21.59,17.53 arc-90 21.21,17.14 18.16,17.14 arc-90 17.78,17.53 17.78,17.78 arc90 17.46,18.1 X1.6
N$27
  Top 0.254: C11.2 23.2,17.94 R14.1 R15.1 17.18,16.35 arc-45 16.96,16.44 16.67,16.73 arc45 16.44,16.83 X1.5
N$28
  Top 0.254: C19.2 R17.1 23.02,13.18 arc90 22.54,12.7 arc-90 21.91,12.06 17.78,12.06 arc-90 17.14,12.7 arc90 16.83,13.02 X1.2
N$29
  Top 0.254: X1.11 18.8,20.71 18.8,23.88 19.15,24.23 R11.2
N$30  (via drill 0.3)
  Top 0.254: IC3.27 40.25,15.71 40.64,15.32 40.64,14.14 v40.31,13.81 | v22.1,25.4 R11.1
  Bottom 0.254: v22.1,25.4 29.21,25.4 31.75,22.86 31.75,15.24 33.18,13.81 v40.31,13.81
N$31  (via drill 0.3)
  Top 0.254: R18.1 21.57,6.99 v22.92,8.33 | v41.2,9.05 41.2,11.51 39.49,13.21 IC3.25
  Bottom 0.254: v22.92,8.33 40.48,8.33 v41.2,9.05
N$34
  Top 0.406: IC2.31 37.94,32.04 37.69,32.29 LED1.C
N$37  (via drill 0.3)
  Top 0.254: C2.2 40.6,45.27 Q1.1 | v44.58,39.62 44.38,39.43 IC2.19
  Bottom 0.254: Q1.1 43.94,41.81 43.94,40.26 v44.58,39.62
N$38  (via drill 0.3)
  Top 0.254: C1.1 35.6,45.27 Q1.2 | v43.69,39.5 43.58,39.39 IC2.20
  Bottom 0.254: v43.69,39.5 42.55,39.5 41.4,40.64 41.4,41.78 37.97,45.21 Q1.2
N$39
  Top 0.406: R20.1 PWR.A
N$40
  Top 0.406: LED1.A 35.23,30.39 R19.1
PA0
  Top 0.305: IC2.6 44.38,28.64 PORTA.1
PA1
  Top 0.305: IC2.5 43.58,28.18 PORTA.2
PA2
  Top 0.305: IC2.4 42.78,27.92 PORTA.3
PA3
  Top 0.305: IC2.3 41.98,28.39 PORTA.4
RSTN  (via drill 0.3)
  Top 0.254: IC3.37 37.99,23.01 v38.1,23.11 | R6.1 23.75,32.51 v20.19,28.96 20.83,28.32 R9.1
  Bottom 0.254: v38.1,23.11 38.1,25.4 37.59,25.91 24.13,25.91 20.64,29.4 | 20.64,29.4 19.18,30.86 15.88,30.86 CS.5 | 20.64,29.4 v20.19,28.96
RTS#
  Top 0.254: UART.6 46.48,42.42 42.04,42.42 41.43,41.81 41.43,40.04 41.18,39.78 IC2.23
RX+
  Top 0.254: C16.1 R15.2 26.45,16.35 arc90 26.83,16.73 26.83,17.33 arc-90 27.21,17.71 IC3.6
RX-
  Top 0.254: C12.2 R14.2 25.97,18.21 IC3.5
RXD
  Top 0.254: IC2.21 42.78,39.6 43.56,40.39 44.45,40.39 UART.5
SCLK  (via drill 0.3)
  Top 0.254: IC3.33 40.7,18.71 41.67,19.68 41.67,25.82 v41.91,26.06 | R3.1 25.65,37.08 v24.89,36.32 | R8.1 25.59,30.04 v26.16,30.61
  Bottom 0.254: v26.16,30.61 26.16,30.48 25.78,30.1
  Bottom 0.305: 41.91,26.04 v41.91,26.06 38.76,29.21 26.67,29.21 25.78,30.1 24.89,30.99 v24.89,36.32 24.89,43.43 23.88,44.45 22.19,44.45 20.92,45.72 SPI.8
SCSN  (via drill 0.3)
  Top 0.254: IC3.32 41.58,18.21 v41.91,18.54 | R2.1 25.91,38.61 25.21,37.91 R1.1 24.19,36.89 20.07,32.77 CS.9
  Top 0.305: CS.1 CS.3
  Bottom 0.254: CS.3 12.7,34.04 17.78,34.04 CS.9 24.89,26.92 38.61,26.92 40.13,25.4 40.13,20.32 v41.91,18.54
SS
  Top 0.305: CS.10 19.05,42.13 SPI.5
TD+  (via drill 0.3)
  Top 0.254: IC3.2 30.1,19.71 arc-90 29.15,20.66 29.15,21.61 arc90 28.77,21.91 27.84,21.91 arc90 27.46,21.61 27.46,21.62 arc-90 27.16,21.37 v26.99,21.37 R13.1
  Bottom 0.254: X1.1 17.14,11.75 arc90 17.78,12.38 17.78,16.19 arc-90 18.41,16.83 26.35,16.83 arc90 26.99,17.46 v26.99,21.37
TD-  (via drill 0.3)
  Top 0.254: R12.1 v26.99,22.83 28.77,22.83 arc-90 29.65,21.94 29.65,20.59 arc90 30.04,20.21 IC3.1
  Bottom 0.254: X1.3 16.51,14.29 arc90 17.14,14.92 17.14,16.83 arc-90 17.78,17.46 21.84,17.46 arc90 22.23,17.84 22.23,18.03 arc-90 22.61,18.41 23.51,18.41 arc-90 23.89,18.03 23.89,17.84 arc90 24.28,17.46 25.08,17.46 arc90 25.72,18.1 25.72,22.19 arc-90 26.35,22.83 v26.99,22.83
TXD
  Top 0.254: IC2.22 41.98,40.46 UART.4

### Text on the board
tPlace: 6 | 1 | CS4 | CS2 | CS1 | CS3 | SS | SCSn | SCSn | RSTn | INTn | SCSn | W5500-Adapter / V1.0 / www.eHaJo.de